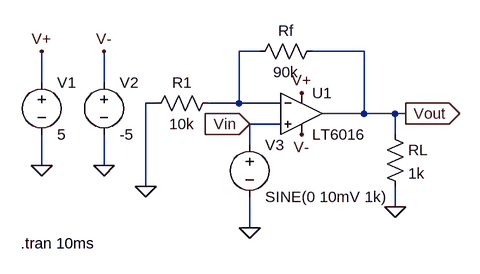
[diagram p0: schematic Task 2 – Non-Inverting Amplifier.asc]
Task 2 – Non-Inverting Amplifier.asc, the LTspice schematic file:
Version 4.1
SHEET 1 880 680
WIRE 224 48 192 48
WIRE 384 48 304 48
WIRE -112 96 -112 48
WIRE -16 96 -16 48
WIRE 64 128 48 128
WIRE 192 128 192 48
WIRE 192 128 144 128
WIRE 256 128 192 128
WIRE 384 144 384 48
WIRE 384 144 320 144
WIRE 432 144 384 144
WIRE 448 144 432 144
WIRE 256 160 208 160
WIRE 432 176 432 144
WIRE 208 192 208 160
WIRE -112 224 -112 176
WIRE -16 224 -16 176
WIRE 48 256 48 128
WIRE 432 288 432 256
WIRE 208 320 208 272
FLAG 448 144 Vout
IOPIN 448 144 Out
FLAG -112 224 0
FLAG -16 224 0
FLAG 432 288 0
FLAG -112 48 V+
FLAG -16 48 V-
FLAG 288 112 V+
FLAG 288 176 V-
FLAG 48 256 0
FLAG 208 320 0
FLAG 208 160 Vin
IOPIN 208 160 In
SYMBOL voltage -112 80 R0
SYMATTR InstName V1
SYMATTR Value 5
SYMBOL voltage -16 80 R0
SYMATTR InstName V2
SYMATTR Value -5
SYMBOL voltage 208 176 R0
WINDOW 123 0 0 Left 0
WINDOW 39 0 0 Left 0
SYMATTR InstName V3
SYMATTR Value SINE(0 10mV 1k)
SYMBOL res 320 32 R90
WINDOW 0 0 56 VBottom 2
WINDOW 3 32 56 VTop 2
SYMATTR InstName Rf
SYMATTR Value 90k
SYMBOL res 416 160 R0
SYMATTR InstName RL
SYMATTR Value 1k
SYMBOL res 160 112 R90
WINDOW 0 0 56 VBottom 2
WINDOW 3 32 56 VTop 2
SYMATTR InstName R1
SYMATTR Value 10k
SYMBOL OpAmps\\LT6016 288 144 R0
SYMATTR InstName U1
TEXT -144 344 Left 2 !.tran 10ms

The netlist it stands for:
* Task 2 – Non-Inverting Amplifier.asc
V1 V+ 0 5
V2 V- 0 -5
V3 Vin 0 SINE(0 10mV 1k)
Rf Vout N001 90k
RL Vout 0 1k
R1 N001 0 10k
* U1: LT6016 (symbol OpAmps\LT6016 not available, pins judged from their places): In+=Vin In-=N001 V+=V+ V-=V- OUT=Vout
.tran 10ms
.backanno
.end